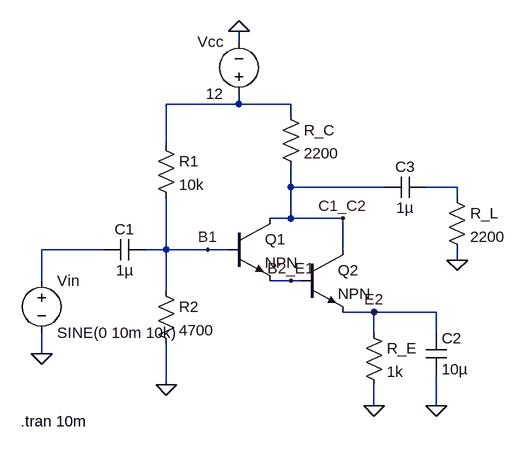
[diagram p0: schematic pratica1eletronica2.asc]
pratica1eletronica2.asc, the LTspice schematic file:
Version 4
SHEET 1 880 680
WIRE 224 -224 224 -240
WIRE 224 -128 224 -144
WIRE 224 -128 112 -128
WIRE 304 -128 224 -128
WIRE 304 -112 304 -128
WIRE 112 -64 112 -128
WIRE 304 0 304 -32
WIRE 448 0 304 0
WIRE 560 0 512 0
WIRE 560 16 560 0
WIRE 304 48 304 0
WIRE 304 48 272 48
WIRE 384 48 304 48
WIRE 16 96 -80 96
WIRE 112 96 112 16
WIRE 112 96 80 96
WIRE 176 96 112 96
WIRE 208 96 176 96
WIRE 384 96 384 48
WIRE 560 112 560 96
WIRE -80 144 -80 96
WIRE 304 144 272 144
WIRE 320 144 304 144
WIRE 112 160 112 96
WIRE 432 192 384 192
WIRE 528 192 432 192
WIRE 432 224 432 192
WIRE 528 224 528 192
WIRE -80 256 -80 224
WIRE 112 304 112 240
WIRE 432 336 432 304
WIRE 528 336 528 288
FLAG -80 256 0
FLAG 112 304 0
FLAG 432 336 0
FLAG 528 336 0
FLAG 560 112 0
FLAG 224 -240 0
FLAG 176 96 B1
FLAG 304 144 B2_E1
FLAG 384 48 C1_C2
FLAG 432 192 E2
SYMBOL voltage -80 128 R0
WINDOW 123 0 0 Left 0
WINDOW 39 0 0 Left 0
SYMATTR InstName Vin
SYMATTR Value SINE(0 10m 10k)
SYMBOL cap 80 80 R90
WINDOW 0 0 32 VBottom 2
WINDOW 3 32 32 VTop 2
SYMATTR InstName C1
SYMATTR Value 1µ
SYMBOL res 96 -80 R0
SYMATTR InstName R1
SYMATTR Value 10k
SYMBOL res 96 144 R0
SYMATTR InstName R2
SYMATTR Value 4700
SYMBOL res 288 -128 R0
SYMATTR InstName R_C
SYMATTR Value 2200
SYMBOL res 416 208 R0
SYMATTR InstName R_E
SYMATTR Value 1k
SYMBOL cap 512 224 R0
SYMATTR InstName C2
SYMATTR Value 10µ
SYMBOL cap 512 -16 R90
WINDOW 0 0 32 VBottom 2
WINDOW 3 32 32 VTop 2
SYMATTR InstName C3
SYMATTR Value 1µ
SYMBOL res 544 0 R0
SYMATTR InstName R_L
SYMATTR Value 2200
SYMBOL npn 208 48 R0
SYMATTR InstName Q1
SYMBOL npn 320 96 R0
SYMATTR InstName Q2
SYMBOL voltage 224 -128 R180
WINDOW 0 24 96 Left 2
WINDOW 3 24 16 Left 2
SYMATTR InstName Vcc
SYMATTR Value 12
TEXT -112 360 Left 2 !.tran 10m

The netlist it stands for:
* pratica1eletronica2.asc
Vin N003 0 SINE(0 10m 10k)
C1 B1 N003 1µ
R1 N001 B1 10k
R2 B1 0 4700
R_C N001 C1_C2 2200
R_E E2 0 1k
C2 E2 0 10µ
C3 N002 C1_C2 1µ
R_L N002 0 2200
Q1 C1_C2 B1 B2_E1 0 NPN
Q2 C1_C2 B2_E1 E2 0 NPN
Vcc N001 0 12
.model NPN NPN
.model PNP PNP
.lib standard.bjt
.tran 10m
.backanno
.end